# EAGLE design V0p2_Main_PCB2 (EAGLE 7.1.0)
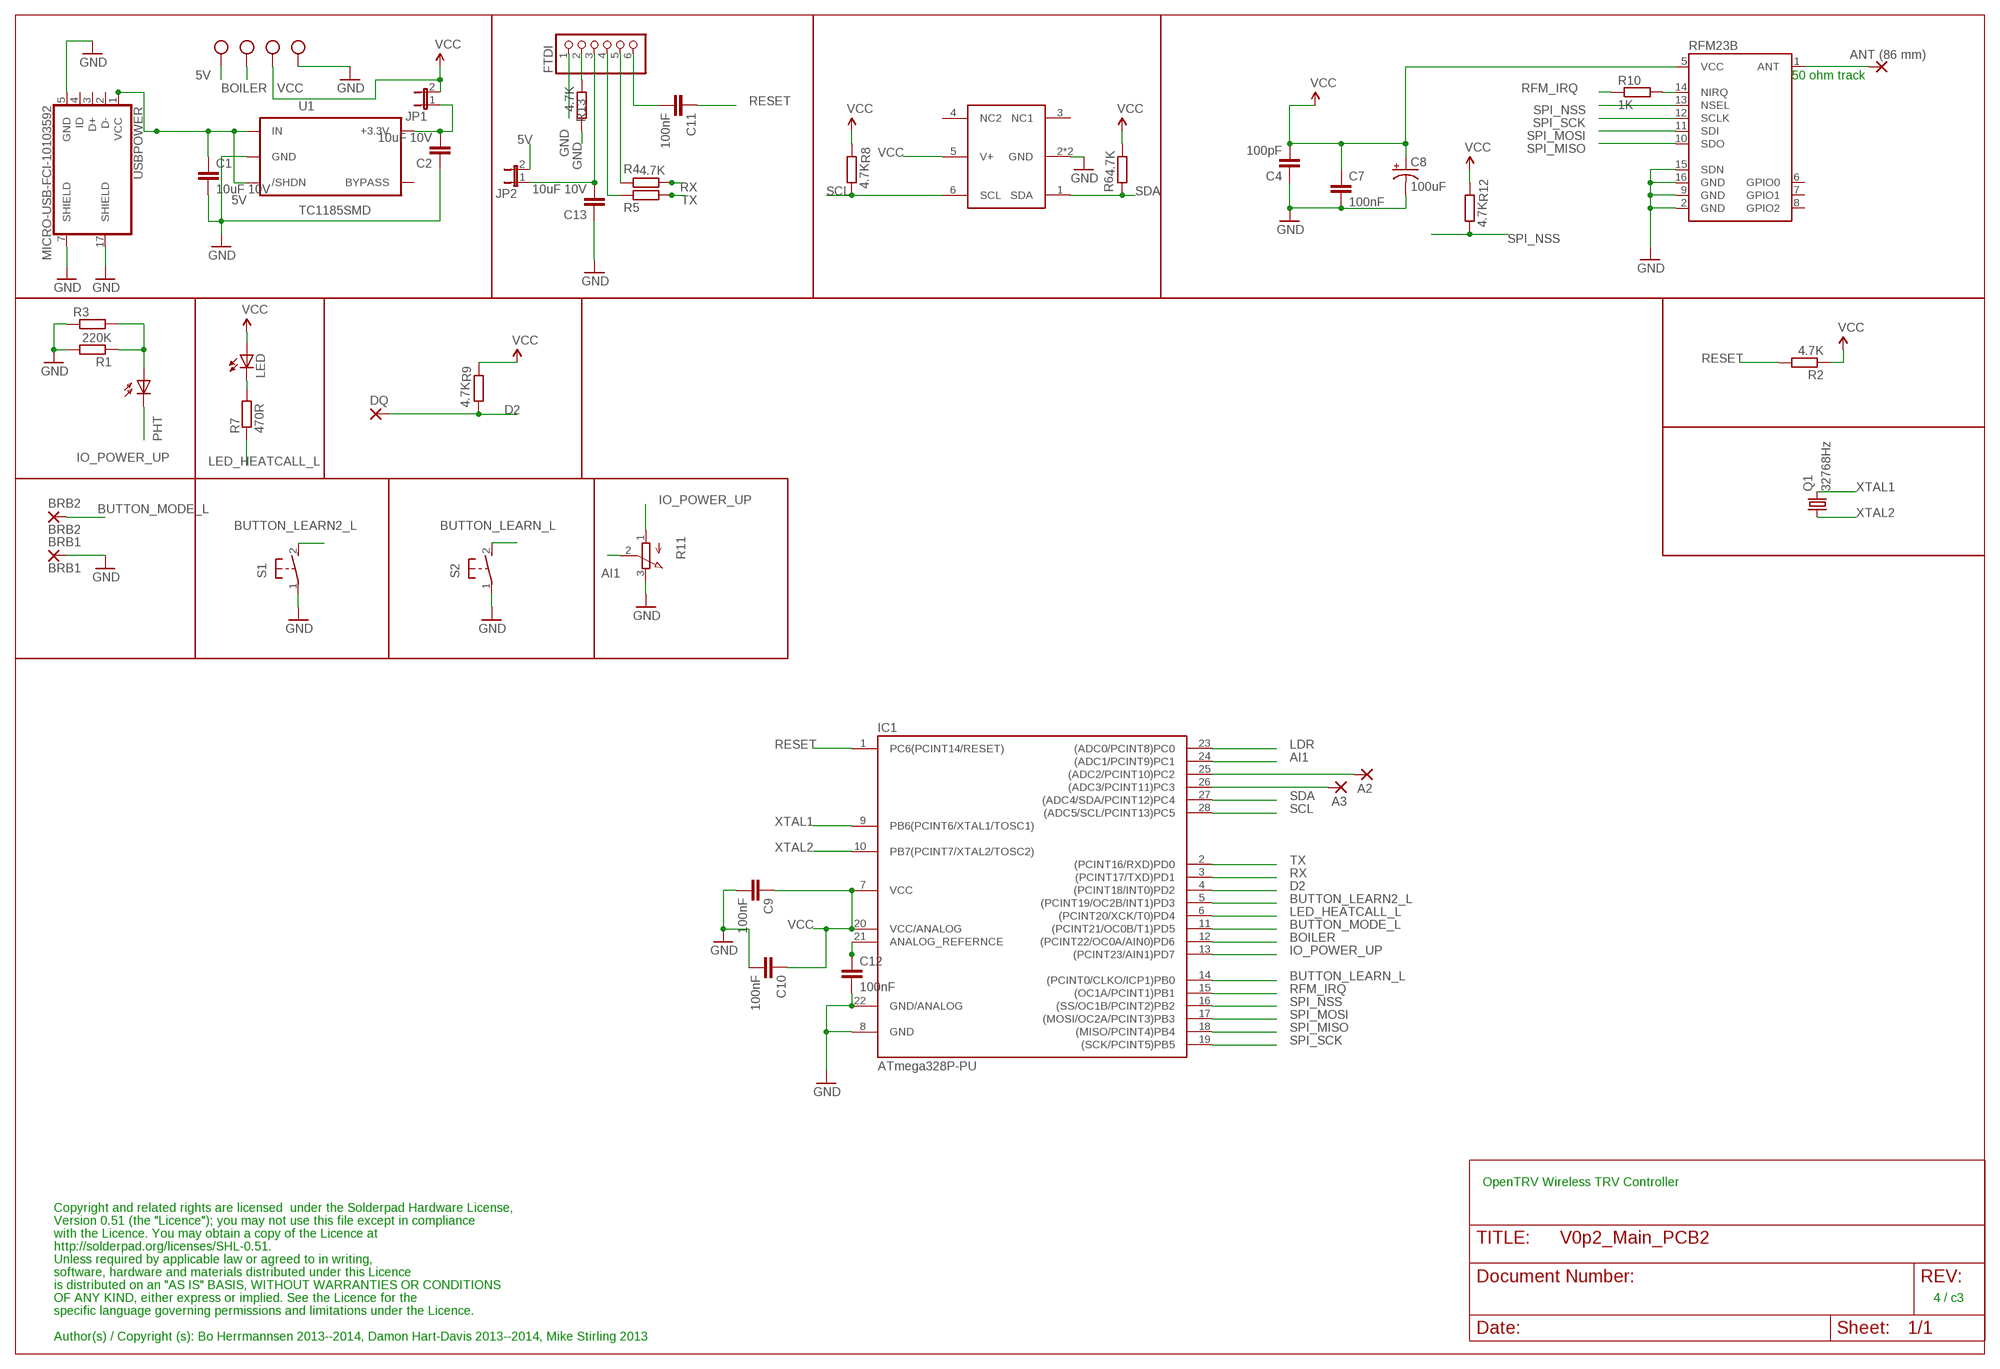
[diagram p0: schematic, sheet 1]

## Parts
A2  2,15/1,0  [2,15/1,0]
A3  2,15/1,0  [2,15/1,0]
ANT1  ANT (86 mm)  2,15/1,0  [2,15/1,0]
BRB1  BRB1  2,15/1,0  [2,15/1,0]
BRB2  BRB2  2,15/1,0  [2,15/1,0]
C1  10uF 10V  C-EUC0603  [C0603]
C2  10uF 10V  C-EUC0603  [C0603]
C4  100pF  C-EUC0603  [C0603]
C7  100nF  C-EUC0603  [C0603]
C8  100uF  CAP_POL1206  [EIA3216]
C9  100nF  C-EUC0603  [C0603]
C10  100nF  C-EUC0603  [C0603]
C11  100nF  C-EUC0603  [C0603]
C12  100nF  C-EUC0603  [C0603]
C13  10uF 10V  C-EUC0603  [C0603]
DQ  2,15/1,0  [2,15/1,0]
FTDI  PINHD-1X6/90  [1X06/90]
IC1  ATmega328P-PU  ATMEGA168-PU  [DIL28-3]
JP1  JP1E  [JP1]
JP2  JP1E  [JP1]
LED  LED3MM  [LED3MM]
PHT  BPX65  [BPX65]
Q1  32768Hz  MC-306  [MC-306]
R1  220K  R-EU_R0603  [R0603]
R2  4.7K  R-EU_R0603  [R0603]
R3  R-EU_0309/V  [0309V]
R4  4.7K  R-EU_R0603  [R0603]
R5  4.7K  R-EU_R0603  [R0603]
R6  4.7K  R-EU_R0603  [R0603]
R7  470R  R-EU_R0603  [R0603]
R8  4.7K  R-EU_R0603  [R0603]
R9  4.7K  R-EU_R0603  [R0603]
R10  1K  R-EU_R0603  [R0603]
R11  EVUE2A  [EVUE]
R12  4.7K  R-EU_R0603  [R0603]
R13  4.7K  R-EU_R0603  [R0603]
RFM23B  RFM23B  [RFM23-XXX-S1]
S1  31-XX  [B3F-31XX]
S2  31-XX  [B3F-31XX]
U1  TC1185SMD  [TC1185]
U$4  SHT21  [SHT21]
USBPOWER  MICRO-USB-FCI-10103592  [MICRO-USB-FCI-10103592]
X1  W237-102  [SCREWTERMINAL]
X2  W237-102  [SCREWTERMINAL]

## Nets
5V [supply]: C1.1 JP2.2 U1.1(IN) U1.3(/SHDN) USBPOWER.1(VCC) X1.2
AI1: IC1.24((ADC1/PCINT9)PC1) R11.2(S)
BOILER: IC1.12((PCINT22/OC0A/AIN0)PD6) X1.1
BUTTON_LEARN2_L: IC1.5((PCINT19/OC2B/INT1)PD3) S1.2(S)
BUTTON_LEARN_L: IC1.14((PCINT0/CLKO/ICP1)PB0) S2.2(S)
BUTTON_MODE_L: BRB2.1(P) IC1.11((PCINT21/OC0B/T1)PD5)
D2: DQ.1(P) IC1.4((PCINT18/INT0)PD2) R9.1
GND [supply]: BRB1.1(P) C1.2 C2.1 C4.1 C7.2 C8.C(-) C9.2 C10.2 C12.2 C13.1 FTDI.1 IC1.8(GND) IC1.22(GND/ANALOG) R1.2 R3.1 R11.3(E) R13.2 RFM23B.2(GND) RFM23B.9(GND) RFM23B.15(SDN) RFM23B.16(GND) S1.1(P) S2.1(P) U1.2(GND) U$4.2(GND) U$4.P$1(GND) USBPOWER.5(GND) USBPOWER.7(SHIELD) USBPOWER.17(SHIELD) X2.2
IO_POWER_UP [supply]: IC1.13((PCINT23/AIN1)PD7) PHT.K(C) R11.1(A)
LDR: IC1.23((ADC0/PCINT8)PC0) PHT.A R1.1 R3.2
LED_HEATCALL_L: IC1.6((PCINT20/XCK/T0)PD4) R7.1
N$1: C11.2 FTDI.6
N$3: FTDI.4 R5.2
N$5: FTDI.5 R4.2
N$6 [supply]: C12.1 IC1.21(ANALOG_REFERNCE)
N$7: R10.2 RFM23B.14(NIRQ)
N$8 [supply]: C2.2 JP1.1 U1.5(+3.3V)
N$11 [supply]: C13.2 FTDI.3 JP2.1
N$13: LED.K(C) R7.2
N$14: FTDI.2 R13.1
N$24: A2.1(P) IC1.25((ADC2/PCINT10)PC2)
N$25: A3.1(P) IC1.26((ADC3/PCINT11)PC3)
N$31 [ant]: ANT1.1(P) RFM23B.1(ANT)
RESET: C11.1 IC1.1(PC6(PCINT14/RESET)) R2.2
RFM_IRQ: IC1.15((OC1A/PCINT1)PB1) R10.1
RX: IC1.3((PCINT17/TXD)PD1) R4.1
SCL: IC1.28((ADC5/SCL/PCINT13)PC5) R8.1 U$4.6(SCL)
SDA: IC1.27((ADC4/SDA/PCINT12)PC4) R6.2 U$4.1(SDA)
SPI_MISO: IC1.18((MISO/PCINT4)PB4) RFM23B.10(SDO)
SPI_MOSI: IC1.17((MOSI/OC2A/PCINT3)PB3) RFM23B.11(SDI)
SPI_NSS: IC1.16((SS/OC1B/PCINT2)PB2) R12.1 RFM23B.13(NSEL)
SPI_SCK: IC1.19((SCK/PCINT5)PB5) RFM23B.12(SCLK)
TX: IC1.2((PCINT16/RXD)PD0) R5.1
VCC [supply]: C4.2 C7.1 C8.A(+) C9.1 C10.1 IC1.7(VCC) IC1.20(VCC/ANALOG) JP1.2 LED.A R2.1 R6.1 R8.2 R9.2 R12.2 RFM23B.5(VCC) U$4.5(V+) X2.1
XTAL1: IC1.9(PB6(PCINT6/XTAL1/TOSC1)) Q1.4
XTAL2: IC1.10(PB7(PCINT7/XTAL2/TOSC2)) Q1.1
Unconnected: RFM23B.6(GPIO0) RFM23B.7(GPIO1) RFM23B.8(GPIO2) U1.4(BYPASS) U$4.3(NC1) U$4.4(NC2) USBPOWER.2(D-) USBPOWER.3(D+) USBPOWER.4(ID)

## Notes on the sheet
- 50 ohm track
- OpenTRV Wireless TRV Controller
- Copyright and related rights are licensed  under the Solderpad Hardware License,
- Version 0.51 (the "Licence"); you may not use this file except in compliance
- with the Licence. You may obtain a copy of the Licence at
- http://solderpad.org/licenses/SHL-0.51.
- Unless required by applicable law or agreed to in writing,
- software, hardware and materials distributed under this Licence
- is distributed on an "AS IS" BASIS, WITHOUT WARRANTIES OR CONDITIONS
- OF ANY KIND, either express or implied. See the Licence for the | 4 / c3
- specific language governing permissions and limitations under the Licence.
- Author(s) / Copyright (s): Bo Herrmannsen 2013--2014, Damon Hart-Davis 2013--2014, Mike Stirling 2013

## Library data of the parts
A2 A3 ANT1 BRB1 BRB2 DQ = wirepad:2,15/1,0: THROUGH-HOLE PAD
C1 C2 C4 C7 C9-C13 = resistor:C-EU: CAPACITOR, European symbol
C8 = SparkFun-Passives:CAP_POL: Capacitor Polarized These are standard SMD and PTH capacitors. Normally 10uF, 47uF, and 100uF in electrolytic and tantalum varieties. Always verify the external diameter of the through hole cap, it varies with capacity, voltage, and manufacturer. The EIA devices should be standard.
FTDI = pinhead:PINHD-1X6: PIN HEADER
IC1 = Arduino-AVR:ATMEGA168-PU
JP1 JP2 = jumper:JP1E: JUMPER
LED = adafruit:LED: LED OSRAM: - CHIPLED LG R971, LG N971, LY N971, LG Q971, LY Q971, LO R971, LY R971 LH N974, LH R974 LS Q976, LO Q976, LY Q976 LO Q996 - Hyper CHIPLED LW Q18S LB Q993, LB Q99A, LB R99A - SideLED LS A670, LO A670, LY A670, LG A670, LP A670 LB A673, LV A673, LT A673, LW A673 LH A674 LY A675 LS A676, LA A676, LO A676, LY A676, LW A676 LS A679, LY A679, LG A679 - Hyper Micro SIDELED® LS Y876, LA Y876, LO Y876, LY Y876 LT Y87S - SmartLED LW L88C, LW L88S LB L89C, LB L89S, LG L890 LS L89K, LO L89K, LY L89K LS L896, LA L896, LO L896, LY L896 - TOPLED LS T670, LO T670, LY T670, LG T670, LP T670 LSG T670, LSP T670, LSY T670, LOP T670, LYG T670 LG T671, LOG T671, LSG T671 LB T673, LV T673, LT T673, LW T673 LH T674 LS T676, LA T676, LO T676, LY T676, LB T676, LH T676, LSB T676, LW T676 LB T67C, LV T67C, LT T67C, LS T67K, LO T67K, LY T67K, LW E67C LS E67B, LA E67B, LO E67B, LY E67B, LB E67C, LV E67C, LT E67C LW T67C LS T679, LY T679, LG T679 LS T770, LO T770, LY T770, LG T770, LP T770 LB T773, LV T773, LT T773, LW T773 LH T774 LS E675, LA E675, LY E675, LS T675 LS T776, LA T776, LO T776, LY T776, LB T776 LHGB T686 LT T68C, LB T68C - Hyper Mini TOPLED® LB M676 - Mini TOPLED Santana® LG M470 LS M47K, LO M47K, LY M47K Source: http://www.osram.convergy.de/
PHT = opto-trans-siemens:BPX65: PHOTO DIODE; MPN: BPX65.; OC_FARNELL: 327451; OC_NEWARK: 06WX2764
Q1 = crystal:MC-306: kHz RANGE CRYSTAL UNIT SMD Source: MC-306_405_406_E07X.PDF Homepage <http://www.epsontoyocom.co.jp>; MPN: MC-306 60.0KHZ 100PPM ,12.5PF; OC_FARNELL: 1278040; OC_NEWARK: 31M5576
R1-R10 R12 R13 = resistor:R-EU_: RESISTOR, European symbol
R11 = pot:EVU: 9 mm Square Rotary Potentiometers Source: Panasonic
RFM23B = SparkFun-RF:RFM23B
S1 S2 = adafruit:31-XX: OMRON SWITCH Now with beefier pads!
U1 = 3.3VREG:TC1185
U$4 = SHT21:SHT21: Tempsensor RS No: 709-8868 MRF No: TMP112AIDRLT
USBPOWER = micro-usb-fci-10103592:MICRO-USB-FCI-10103592: Micro USB B Connector RS No: 714-2334 MRF No: 10103592-0001LF
X1 X2 = screwterminal:W237-102: Screw terminal 3.5mm Pitch RS No: 710-0444 MRF No:1776275-2; MPN: 237-102; OC_FARNELL: unknown; OC_NEWARK: 70K9898

## Net classes
0 default: width 0.203 mm
1 supply: width 0.5 mm, clearance 0.203 mm
2 ant: width 2.184 mm

## Board
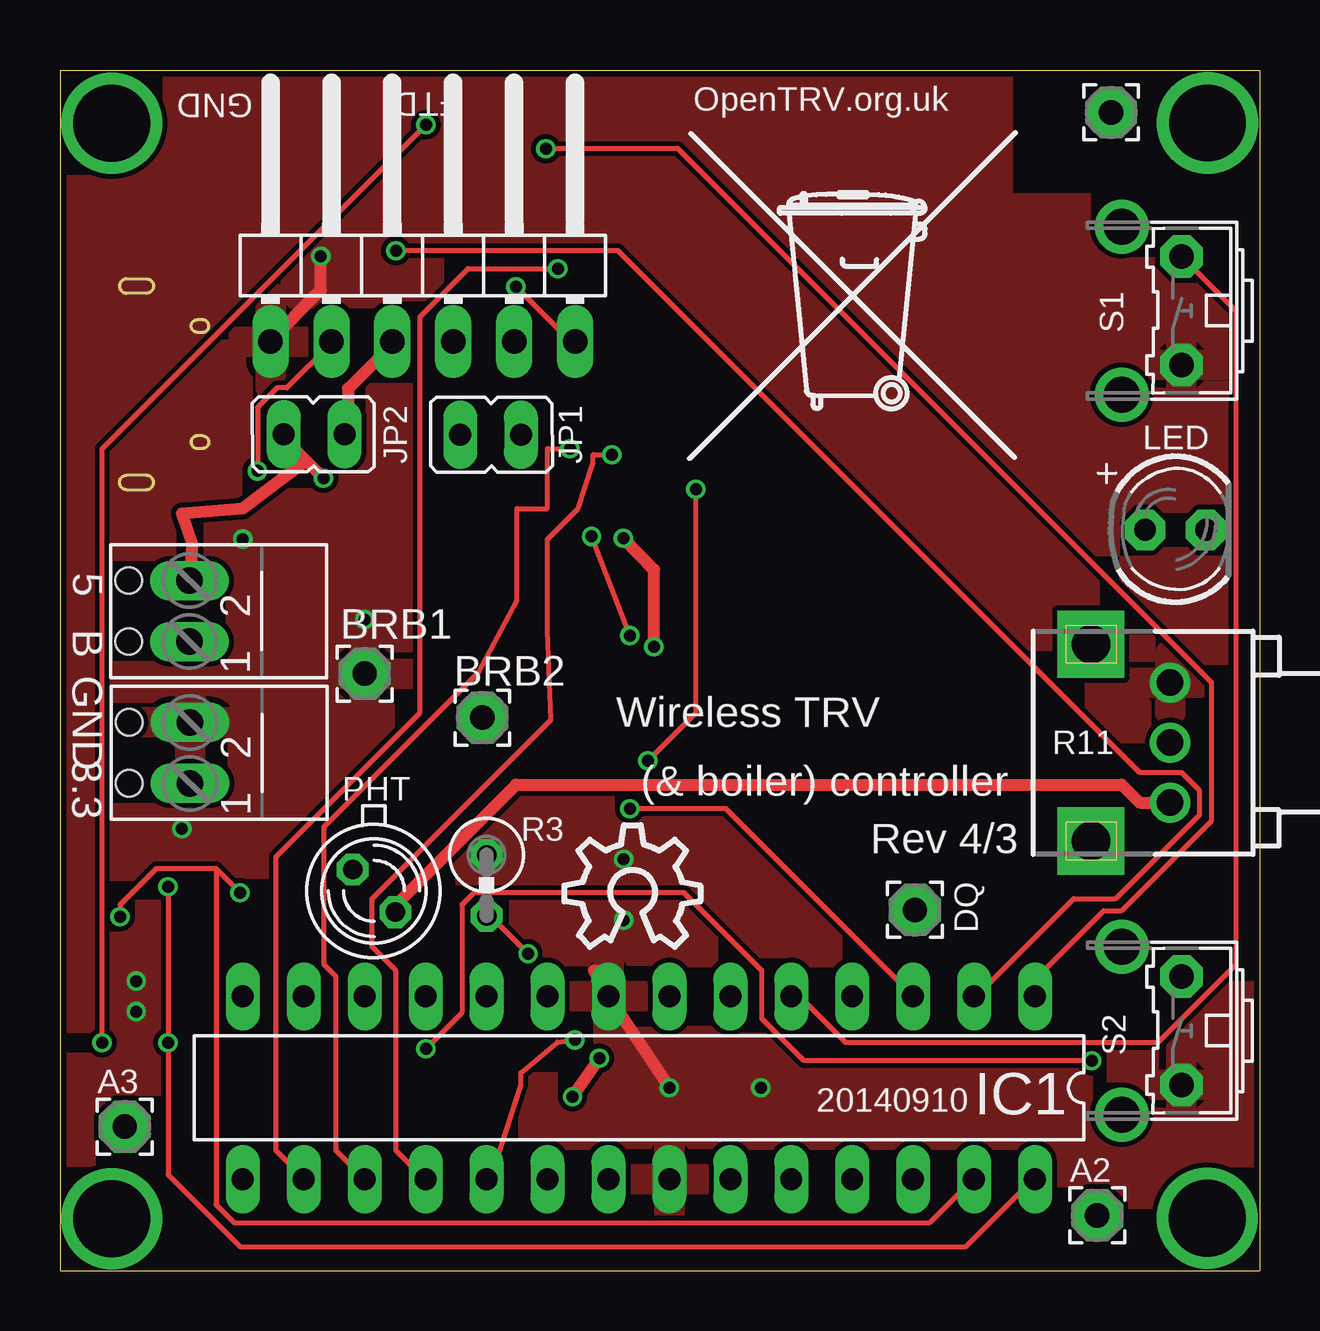
[diagram p1: board, top side]
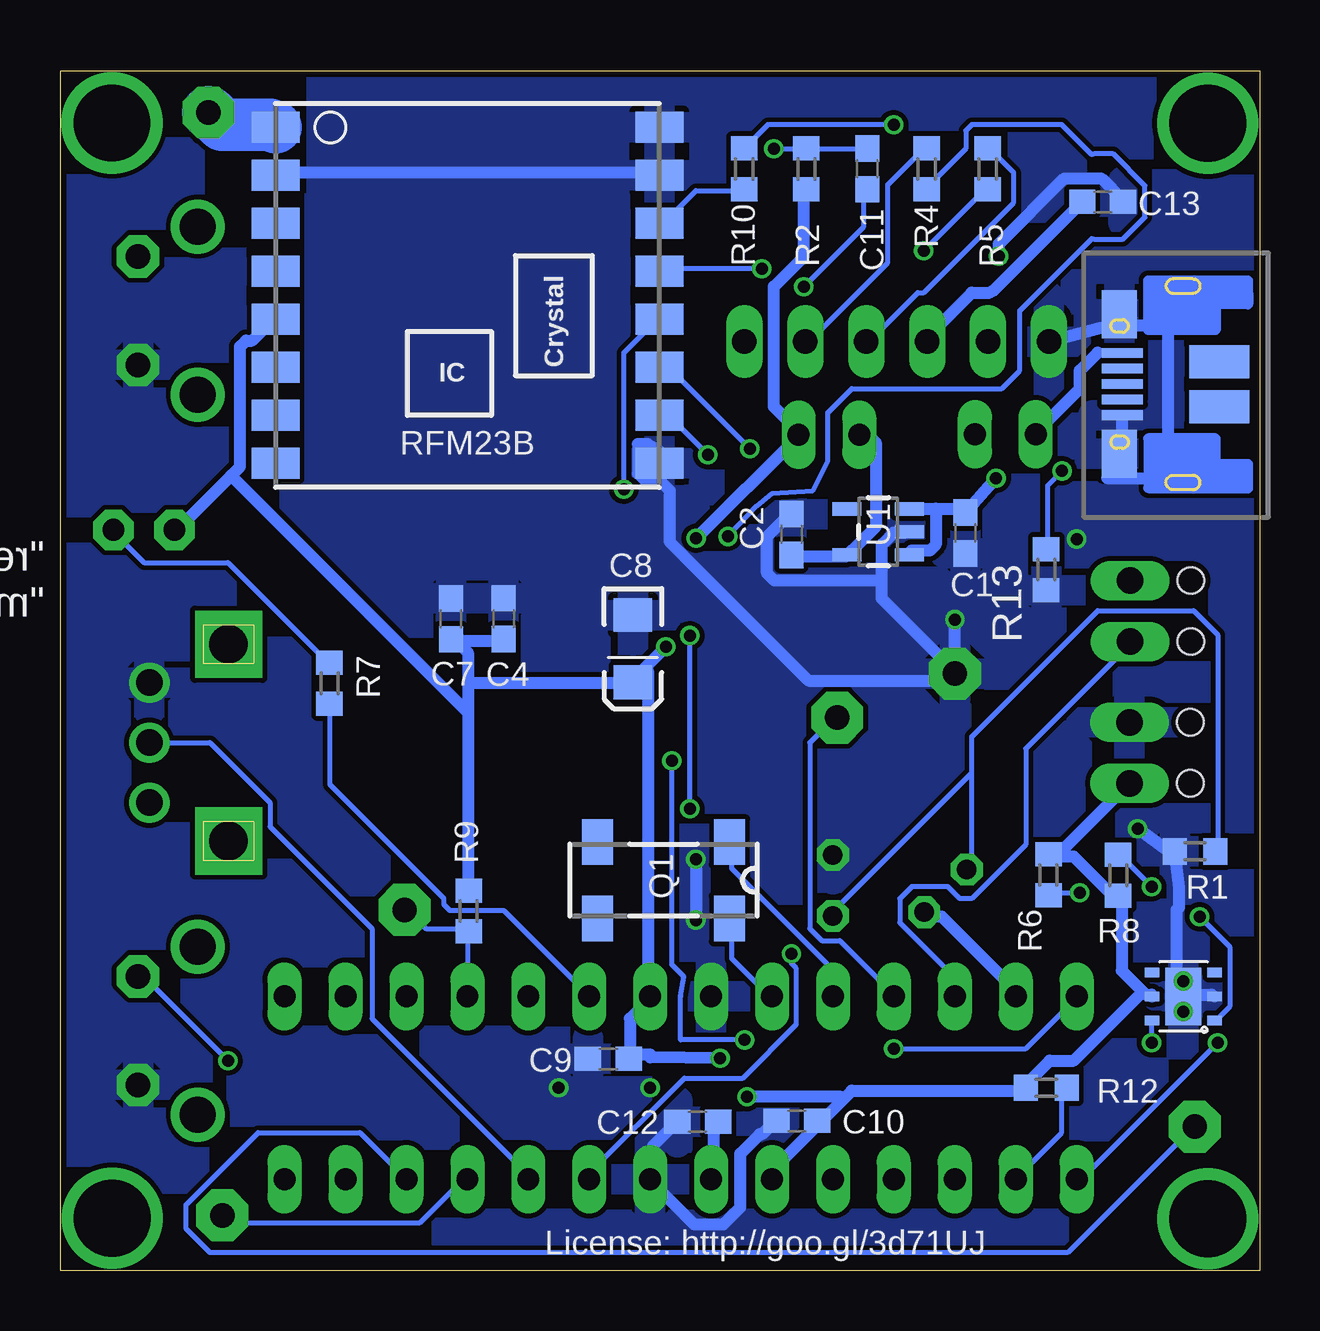
[diagram p2: board, bottom side, seen from below]

Size 50 x 50 mm. Coordinates in mm from the lower left corner, seen from the top.
Outline: 0,0 50,0 50,50 0,50 0,0
Copper layers (1*16): Top 0.035mm / dielectric 1.5mm / Bottom 0.035mm
Design rules "PMServicesStd *": minimum track width 8mil, minimum drill 0.5mm, track to track 8mil, track to pad 8mil, pad to pad 8mil, via to via 8mil, smd to smd 0mil, copper to edge 10mil, drill to drill 10mil, minimum pad ring 10mil, minimum via ring 6mil, stop-mask expansion 2mil, vias tented up to drill 100mil, thermal gap 10mil

### Footprints (pad centres in the part's own frame; a part is rotated, then mirrored left to right if it is on the bottom)
2,15/1,0 = drill 1.016 pad 2.159 octagon: 1 0,0
C0603 = smd 1.1 x 1: 1 -0.85,0; 2 0.85,0
EIA3216 = smd 1.4 x 1.6: A 1.4,0; C -1.4,0
1X06/90 = drill 1.016 long: 1 -6.35,-3.81; 2 -3.81,-3.81; 3 -1.27,-3.81; 4 1.27,-3.81; 5 3.81,-3.81; 6 6.35,-3.81
DIL28-3 = drill 0.914 long: 1 -16.51,-3.81; 2 -13.97,-3.81; 3 -11.43,-3.81; 4 -8.89,-3.81; 5 -6.35,-3.81; 6 -3.81,-3.81; 7 -1.27,-3.81; 8 1.27,-3.81; 9 3.81,-3.81; 10 6.35,-3.81; 11 8.89,-3.81; 12 11.43,-3.81; 13 13.97,-3.81; 14 16.51,-3.81; 15 16.51,3.81; 16 13.97,3.81; 17 11.43,3.81; 18 8.89,3.81; 19 6.35,3.81; 20 3.81,3.81; 21 1.27,3.81; 22 -1.27,3.81; 23 -3.81,3.81; 24 -6.35,3.81; 25 -8.89,3.81; 26 -11.43,3.81; 27 -13.97,3.81; 28 -16.51,3.81
JP1 = drill 0.914 long: 1 0,-1.27; 2 0,1.27
LED3MM = drill 0.914 pad 1.676 octagon: A -1.27,0; K 1.27,0
BPX65 = drill 0.813 octagon: A -0.889,-0.889; K 0.889,0.889
MC-306 = smd 1.3 x 1.9: 1 -2.75,-1.6; 2 2.75,-1.6; 3 2.75,1.6; 4 -2.75,1.6
R0603 = smd 1 x 1.1: 1 -0.85,0; 2 0.85,0
0309V = drill 0.813 octagon: 1 -1.27,0; 2 1.27,0
EVUE = drill 1.1 pad 1.676: 1 0,-2.5; 2 0,0; 3 0,2.5 | drill 1.6 pad 2.8 square: M1 -3.3,4.1; M2 -3.3,-4.1
RFM23-XXX-S1 = smd 2 x 1.3: 1 -8,7; 2 -8,5; 3 -8,3; 4 -8,1; 5 -8,-1; 6 -8,-3; 7 -8,-5; 8 -8,-7; 9 8,-7; 10 8,-5; 11 8,-3; 12 8,-1; 13 8,1; 14 8,3; 15 8,5; 16 8,7
B3F-31XX = drill 1.016 pad 1.778 octagon: 1 -2.261,-1.245; 2 2.261,-1.245 | drill 1.499 pad 2.032: 3 -3.505,1.245; 4 3.505,1.245
TC1185 = smd 0.55 x 1.2: 1 -0.95,-1.3; 2 0,-1.3; 3 0.95,-1.3; 4 0.95,1.3; 5 -0.95,1.3
SHT21 = smd 0.4 x 0.6: 1 -1,-1.3; 2 0,-1.3; 3 1,-1.3; 4 1,1.3; 5 0,1.3; 6 -1,1.3 | smd 2.4 x 1.5: P$1 0,0
MICRO-USB-FCI-10103592 = smd 0.4 x 1.71: 1 3.84,2.51; 2 3.19,2.51; 3 2.54,2.51; 4 1.89,2.51; 5 1.24,2.51 | smd 2 x 1.46: 7 -0.36,2.64; 17 5.44,2.64 | smd 1.375 x 2.5: 11 1.603,-1.52; 12 3.478,-1.52
SCREWTERMINAL = drill 1.1 long: 1 -1.27,-1.27; 2 1.27,-1.27 | hole 1.1: -1.27,1.27; 1.27,1.27

### Placement (x,y rotation side)
A2  43.23,2.31 0 top
A3  2.7,6 0 top
ANT1  43.81,48.26 0 top
BRB1  12.7,24.87 0 top
BRB2  17.6,23.04 180 top
C1  12.27,30.74 270 bottom
C2  19.51,30.68 270 bottom
C4  31.51,27.17 270 bottom
C7  33.7,27.16 90 bottom
C8  26.12,25.92 270 bottom
C9  27.15,8.82 180 bottom
C10  19.28,6.24 180 bottom
C11  16.35,45.91 270 bottom
C12  23.42,6.21 180 bottom
C13  6.54,44.54 180 bottom
DQ  35.64,15.03 0 top
FTDI  15.12,42.52 0 top
IC1  24.13,7.62 180 top
JP1  17.95,34.83 270 top
JP2  10.59,34.85 90 top
LED  46.5,30.86 0 top
PHT  13.09,15.82 270 top
Q1  24.84,16.27 180 bottom
R1  2.68,17.47 180 bottom
R2  18.89,45.91 90 bottom
R3  17.78,16.05 270 top
R4  13.87,45.91 90 bottom
R5  11.33,45.91 90 bottom
R6  8.79,16.49 270 bottom
R7  38.77,24.47 90 bottom
R8  5.89,16.47 270 bottom
R9  32.96,14.99 90 bottom
R10  21.48,45.91 270 bottom
R11  46.27,22 0 top
R12  8.89,7.62 180 bottom
R13  8.89,29.21 270 bottom
RFM23B  33.02,40.64 0 bottom
S1  45.5,40 90 top
S2  45.5,10 90 top
U1  15.89,30.79 90 bottom
U$1  [OSHW_10X200_NOTEXT]  21.02,13.49 0 top
U$2  [TONNE]  32.88,37.88 0 top
U$4  3.17,11.43 90 bottom
USBPOWER  3.2,34.4 90 bottom
X1  4.13,27.48 90 top
X2  4.15,21.57 90 top

### Tracks (layer width: path | path; a pad name or v marks a point on that pad's centre or on a via)
5V  (via drill 0.5)
  Top 0.5: 10.25,33.75 9.25,34.75 JP2.2 | 10.25,33.75 v10.98,33.02 | 10.25,33.75 7.62,31.75 5.08,31.54 5.5,30.27 X1.2
  Bottom 0.4: 6.75,38.25 5.75,38.25 USBPOWER.1
  Bottom 0.5: 13.5,31.75 14.5,31.75 U1.3 | 13.5,31.75 12.5,31.75 C1.1 v10.98,33.02 | 13.5,31.75 13.5,30.25 13.75,30 14.5,30 U1.1 | 6.75,38.25 7.5,37.5 7.5,36.75 9.25,35 JP2.2
AI1
  Bottom 0.203: R11.2 43.75,22 41.25,19.5 41.25,18.5 37,14.25 37,10.5 30.5,4 IC1.24
BOILER
  Bottom 0.203: IC1.12 12.75,11.5 12.75,12.25 15,14.5 15,15.5 14.5,16 13,16 12.5,15.5 12,15.5 9.75,17.75 9.75,21.75 5.5,26 X1.1
BUTTON_LEARN2_L
  Top 0.203: IC1.5 30.5,11.25 31,11.25 32.75,9.5 45.75,9.5 49,12.75 49,40 S1.2
BUTTON_LEARN_L  (via drill 0.5)
  Top 0.203: v15.25,9.25 16.75,10.75 16.75,15.25 17.25,15.75 26,15.75 29.25,12.5 29.25,10.5 31,8.75 v43,8.75
  Bottom 0.203: v15.25,9.25 9.75,9.25 7.75,11.25 IC1.14 | v43,8.75 46.5,12.25 S2.2
BUTTON_MODE_L
  Bottom 0.203: IC1.11 15.25,11.5 17.5,13.75 18.25,13.75 18.75,14.25 18.75,22 17.75,23 BRB2.1
D2
  Bottom 0.203: IC1.4 33,11.5 33,14 R9.1 33,14.25 34.75,14.25 35.5,15 DQ.1
GND  (via drill 0.5)
  Top 0.5: 25.3,7.72 25.33,7.75 | 22.86,11.48 IC1.8 | 22.86,11.79 IC1.8 | IC1.8 v25.4,7.62 | v10.87,42.27 10.87,40.84 8.74,38.71 FTDI.1 | IC1.8 22.25,12.5 22.86,12.5
  Bottom 0.4: 5.75,35.5 USBPOWER.5
  Bottom 0.406: USBPOWER.5 6.35,35.64 | 6.35,33.02 5.84,33.02 USBPOWER.7
  Bottom 0.5: 41.25,45.75 RFM23B.2 41,45.75 25.25,45.75 RFM23B.15 | U$4.2 2,11.5 3,11.5 U$4.P$1 | 5.75,35.5 5.75,34.25 USBPOWER.7 | 15.75,28.75 15.75,28 12.75,25 BRB1.1 | 15.75,28.75 15.75,30.25 15.25,30.75 14.75,30.75 U1.2 | 6.35,33.02 3.81,33.02 3.81,39.37 5.84,39.37 | 5.84,39.37 USBPOWER.17 | C10.2 20.22,6.2 20.73,5.69 20.83,5.69 21.64,4.88 21.64,2.64 22.35,1.93 23.57,1.93 25.4,3.76 IC1.22 25.3,3.96 25.3,5.18 24.28,6.2 C12.2 | 15.75,28.75 20.22,28.75 20.52,29.06 20.52,30.58 19.61,31.5 C2.1 | 5.84,39.37 6.23,39.37 FTDI.1 | U$4.P$1 3.25,12.09 3.45,12.29 3.45,15.04 3.35,15.14 3.35,15.95 R1.2 3.81,17.47 v5.08,18.41 | v12.7,27.13 12.7,25.4 12.39,25.09 12.39,24.79 12.6,24.59 18.8,24.59 24.59,30.38 24.59,32.51 24.99,32.92 25.6,32.92 25.91,33.22 25.91,34.44 25.5,34.44 25.02,34.15 | 3.15,11.48 U$4.P$1 | v23.5,17.14 v23.5,14.61 | v10.87,42.27 10.87,42.77 8.13,45.52 6.6,45.52 5.69,44.6 C13.1 | 25.09,33.63 RFM23B.9 25.09,33.63
  other vias: 3.17,10.79 3.17,12.06 29.21,7.62 7.62,30.48
  pour Bottom: 0,0 50,0 50,50 44.6,50 44.6,44.28 39.09,44.27 39.09,50 0,50
  pour Top: 0,50 0,0 50,0 50,50 44.6,50 44.6,44.28 39.09,44.27 39.09,50
IO_POWER_UP
  Top 0.5: R11.1 45,19.5 44.25,20.25 19,20.25 13.75,15 PHT.K
  Bottom 0.5: PHT.K 13.75,14.75 13.25,14.75 10,11.5 IC1.13
LDR  (via drill 0.5)
  Top 0.203: v19.51,13.21 18.29,14.43 18.19,14.43 17.88,14.73 R3.2
  Bottom 0.203: 12,20.75 12,16.75 PHT.A | 12,20.75 12,22.25 6.75,27.5 2.75,27.5 1.75,26.5 1.75,17.68 1.98,17.68 R1.1 | 12,20.75 17.75,15 R3.2 | v19.51,13.21 19.51,12.8 19.3,12.6 19.3,10.26 21.54,8.03 23.98,8.03 27.94,4.06 IC1.23
LED_HEATCALL_L
  Bottom 0.203: R7.1 38.75,23.5 38.75,20.25 34,15.5 34,15.25 33.75,15 31.5,15 28,11.5 IC1.6
N$1  (via drill 0.5)
  Top 0.203: v19,41 21.25,38.75 FTDI.6
  Bottom 0.203: v19,41 16.5,43.5 16.5,45 C11.2
N$3
  Bottom 0.203: R5.2 11.25,46.75 10.25,45.75 10.25,44.5 14,40.75 14.25,40.75 16.25,38.75 FTDI.4
N$4  (via drill 3.2)
  other vias: 2.16,47.81
N$5
  Bottom 0.203: R4.2 14,46.75 15.5,45.25 15.5,42 18.75,38.75 FTDI.5
N$6
  Bottom 0.5: C12.1 22.75,6 22.75,4 IC1.21
N$7
  Bottom 0.203: R10.2 21.5,45 23.5,45 25,43.5 RFM23B.14
N$8
  Bottom 0.5: C2.2 19.5,29.75 17.25,29.75 U1.5 17,30 16,31 16,34.5 16.5,35 JP1.1
N$11
  Top 0.5: JP2.1 12,35 12,36.75 13.75,38.5 FTDI.3
  Bottom 0.5: FTDI.3 14,38.75 12,40.75 11.25,40.75 11.07,40.84 7.42,44.5 C13.2
N$12  (via drill 3.2)
  other vias: 47.83,2.19
N$13
  Bottom 0.203: R7.2 39,25.5 43,29.5 46.5,29.5 47.75,30.75 LED.K
N$14  (via drill 0.5)
  Top 0.203: v8.23,33.33 8.23,35.97 9.04,36.78 9.45,36.78 11.28,38.61 FTDI.2
  Bottom 0.203: v8.23,33.33 8.84,32.72 8.84,30.07 R13.1
N$19  (via drill 3.2)
  other vias: 47.83,47.82
N$22  (via drill 3.2)
  other vias: 2.16,2.16
N$24
  Bottom 0.203: IC1.25 33.25,3.75 35,2 42.75,2 43,2.25 A2.1
N$25
  Bottom 0.203: IC1.26 37.5,5.75 41.75,5.75 44.75,2.75 44.75,1.75 43.75,0.75 8,0.75 2.75,6 A3.1
N$31
  Bottom 2.184: RFM23B.1 41.25,47.75 43.25,47.75 43.75,48.25 ANT1.1
RESET  (via drill 0.5)
  Top 0.203: v20.25,46.75 25.75,46.75 48,24.5 48,18.75 44.25,15 43.5,15 40.75,12.25 40.75,11.5 IC1.1
  Bottom 0.203: C11.1 16.5,46.75 18.75,46.75 R2.2 19,46.75 v20.25,46.75
RFM_IRQ  (via drill 0.5)
  Top 0.203: v15.25,47.75 1.75,34.25 v1.75,9.5
  Bottom 0.203: v15.25,47.75 20.5,47.75 21.25,47 R10.1 | v1.75,9.5 7.5,3.75 IC1.15
RX  (via drill 0.5)
  Top 0.203: v23.75,26.46 v22.16,30.59 | v23.75,19.25 27.75,19.25 35.5,11.5 IC1.3
  Bottom 0.203: v22.16,30.59 20.95,31.86 20.32,32.38 18.61,32.5 18,33.75 18,35.75 17,36.75 10.75,36.75 10,37.5 10,40 7,43 6.91,42.98 5.69,42.98 4.78,43.89 4.78,45.21 6.1,46.53 6.91,46.53 7,46.5 8.25,47.75 12,47.75 12.25,47.5 12.25,46.75 13.75,45.25 R4.1 | v23.75,19.25 v23.75,26.46
SCL  (via drill 0.5)
  Top 0.203: v4.5,16 v4.5,9.5 4.5,4 7.5,1 37.75,1 40.5,3.75 IC1.28
  Bottom 0.203: v4.5,9.5 4.5,10.25 U$4.6 | v4.5,16 5.75,17.25 R8.1
SDA  (via drill 0.5)
  Top 0.203: v2.5,14.75 2.5,15.25 4,16.75 6.5,16.75 | v7.5,15.75 6.5,16.75 | 6.5,16.75 6.5,2.75 7.25,2 36.25,2 38,3.75 IC1.27
  Bottom 0.203: v2.5,14.75 1.25,13.5 1.25,11 1.75,10.5 U$4.1 | v7.5,15.75 8.75,15.75 R6.2
SPI_MISO  (via drill 0.5)
  Top 0.203: v23,34 22.23,34 22.23,33.66 21.59,31.75 20.32,30.48 20.32,26.67 20.46,22.96 13,15.5 13,13.5 14,12.5 14,5 15,4 IC1.18
  Bottom 0.203: v23,34 24.5,35.5 25,35.5 RFM23B.10
SPI_MOSI  (via drill 0.5)
  Top 0.203: v21.25,34.25 20.32,34.25 20.32,31.75 19.05,31.75 19.05,27.94 17.44,24.94 11,18.5 11,12.75 11.5,12.25 11.5,5 12.5,4 IC1.17
  Bottom 0.203: v21.25,34.25 24.5,37.5 25,37.5 RFM23B.11
SPI_NSS  (via drill 0.5)
  Top 0.203: v20.75,41.75 17,41.75 15,39.75 15,23.25 9,17.25 9,5 10,4 IC1.16
  Bottom 0.203: R12.1 8.25,7.5 8.25,5.75 10,4 IC1.16 | v20.75,41.75 25,41.75 RFM23B.13
SPI_SCK  (via drill 0.5)
  Top 0.203: v26.5,32.56 26.5,23.25 v24.5,21.25 | v21.46,9.62 20.73,9.52 19.21,8.25 19.21,7.75 18,4 IC1.19
  Bottom 0.203: v26.5,32.56 26.5,38.25 25.25,39.5 RFM23B.12 | v24.5,21.25 24.5,12.75 24,12.25 24.13,11.43 24.13,9.62 v21.46,9.62
TX  (via drill 0.5)
  Top 0.203: v14,42.5 23.25,42.5 45,20.75 46.75,20.75 47.5,20 47.5,19 44,15.5 42.25,15.5 38.25,11.5 IC1.2
  Bottom 0.203: v14,42.5 11.5,45 R5.1
VCC  (via drill 0.5)
  Top 0.5: v21.36,7.25 v22.48,8.85 | v24.75,26 24.77,26 24.77,29.21 v23.48,30.52
  Bottom 0.5: 4.88,11.62 5.75,12.5 5.75,15.5 R8.2 6,15.5 7.75,17.25 8.5,17.25 | 4.88,11.62 4.75,11.5 4.5,11.5 U$4.5 | 8.5,17.25 8.75,17.25 R6.1 8.5,17.25 | 8.5,17.25 5.5,20.25 X2.1 | IC1.20 20.5,4 18.5,6 C10.1 18.25,6.25 17.38,7.12 | 17.38,7.12 17,7.5 9.75,7.5 R12.2 9.75,7.75 8.75,8.75 7.75,8.75 4.88,11.62 | v22.48,8.85 25.4,8.89 25.4,9 26,9 C9.1 26.25,9 26.25,10.5 25.5,11.25 IC1.7 25.5,11.5 25.5,25 C8.A | v21.36,7.25 17.5,7.25 17.38,7.12 | 42.88,33.12 45,31 LED.A | 42.88,33.12 42.5,33.5 42.5,38.5 42.25,38.75 42,38.75 41.25,39.5 RFM23B.5 | R2.1 19,45 19,42.25 20.25,41 20.25,36 19.25,35 JP1.2 19.25,34.75 v23.48,30.52 | 33,24.5 33,25.75 33.5,26.25 C7.1 33.25,26.25 31.75,26.25 C4.2 | 33,24.5 33,23.25 | 33,23.25 33,16 R9.2 | 33,24.5 26.25,24.5 C8.A | v24.75,26 26,24.75 C8.A | 33,23.25 42.88,33.12
XTAL1
  Bottom 0.203: Q1.4 22,14.5 22,13 20.5,11.5 IC1.9
XTAL2
  Bottom 0.203: Q1.1 22,17.75 22,16.75 18,12.75 18,11.5 IC1.10

### Text on the board
bPlace: License: http://goo.gl/3d71UJ
tNames: GND | OpenTRV.org.uk | 5 | B | GND | Wireless TRV | 3.3 | (& boiler) controller | Rev 4/3 | 20140910
bNames: "replace milling with slot drilling if rqd" / "min 2.1mm x 1.8mm"